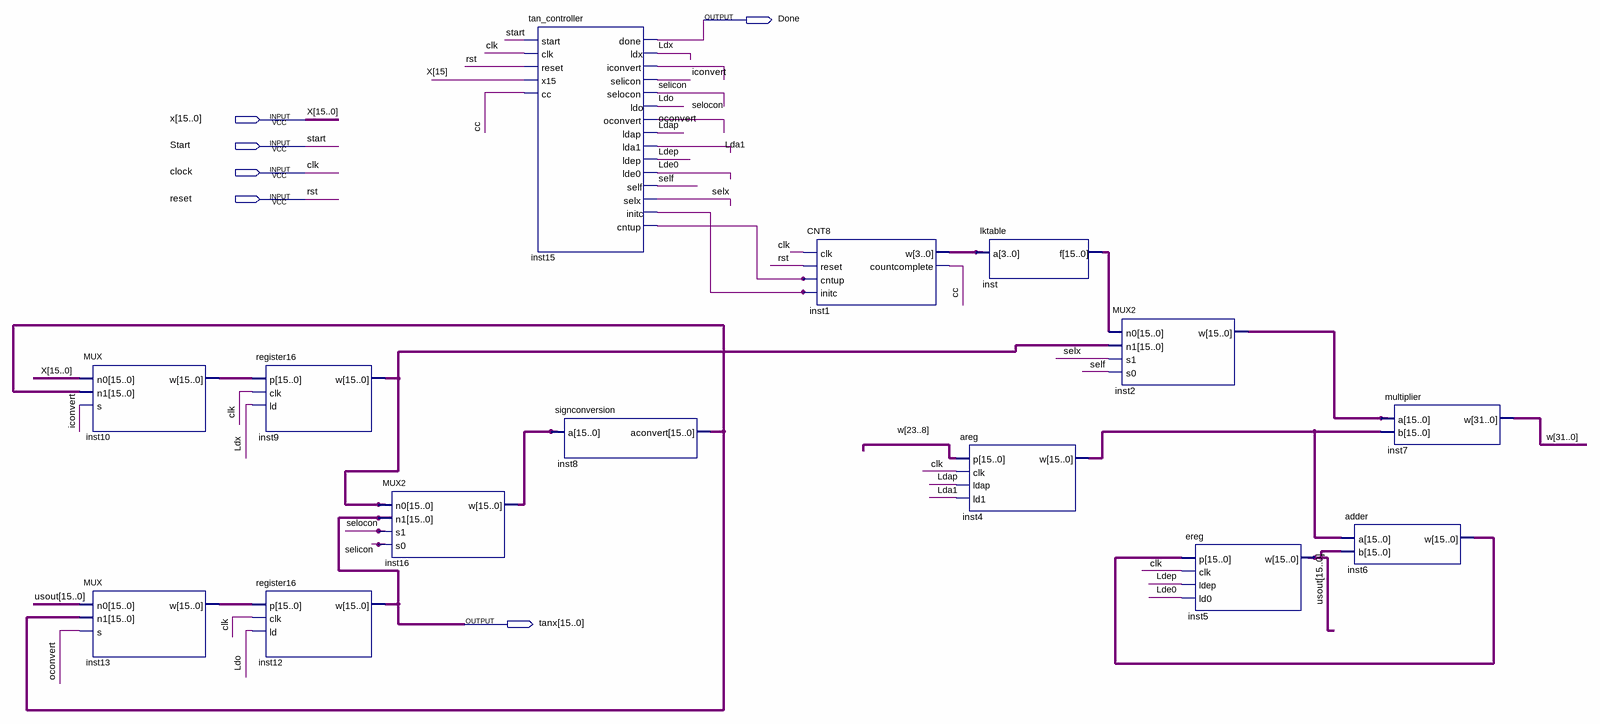
[diagram p0: schematic sheet]
// Quartus schematic tgx.bdf as structural Verilog: 14 symbols, 6 pins
module tgx (
  input  [15:0] x,
  input  Start,
  input  clock,
  input  reset,
  output Done,
  output [15:0] tanx
);

  wire cc, iconvert, inst15_cntup, inst15_initc, Lda1, Ldap, Lde0, Ldep, Ldo, Ldx, oconvert, self, selicon,
       selocon, selx;
  wire [3:0] inst1_w;
  wire [15:0] inst2_w, inst4_w, inst6_w, inst8_aconvert, inst9_w, inst10_w, inst13_w, inst16_w, inst_f, usout;
  wire [31:0] w;

  MUX inst10 (.n0(x), .n1(inst8_aconvert), .s(iconvert), .w(inst10_w));
  MUX inst13 (.n0(usout), .n1(inst8_aconvert), .s(oconvert), .w(inst13_w));
  register16 inst9 (.p(inst10_w), .clk(clock), .ld(Ldx), .w(inst9_w));
  register16 inst12 (.p(inst13_w), .clk(clock), .ld(Ldo), .w(tanx));
  MUX2 inst16 (.n0(inst9_w), .n1(tanx), .s1(selocon), .s0(selicon), .w(inst16_w));
  tan_controller inst15 (
    .start(Start), .clk(clock), .reset(reset), .x15(x[15]), .cc(cc), .done(Done), .ldx(Ldx),
    .iconvert(iconvert), .selicon(selicon), .selocon(selocon), .ldo(Ldo), .oconvert(oconvert), .ldap(Ldap),
    .lda1(Lda1), .ldep(Ldep), .lde0(Lde0), .self(self), .selx(selx), .initc(inst15_initc),
    .cntup(inst15_cntup));
  signconversion inst8 (.a(inst16_w), .aconvert(inst8_aconvert));
  CNT8 inst1 (.clk(clock), .reset(reset), .cntup(inst15_cntup), .initc(inst15_initc), .w(inst1_w), .countcomplete(cc));
  areg inst4 (.p(w[23:8]), .clk(clock), .ldap(Ldap), .ld1(Lda1), .w(inst4_w));
  lktable inst (.a(inst1_w), .f(inst_f));
  MUX2 inst2 (.n0(inst_f), .n1(inst9_w), .s1(selx), .s0(self), .w(inst2_w));
  ereg inst5 (.p(inst6_w), .clk(clock), .ldep(Ldep), .ld0(Lde0), .w(usout));
  multiplier inst7 (.a(inst2_w), .b(inst4_w), .w(w));
  adder inst6 (.a(inst4_w), .b(usout), .w(inst6_w));

  // Other names for the same wires on the sheet: clk = clock; rst = reset
endmodule
